# EAGLE schematic Omniband_v1-05-22_EVT_TPS_30101DRI_PL_FIR_QFN (EAGLE 9.6.2)
COMPANY: ADAFRUIT INDUSTRIES; DRAWN: KTOWN; REV: F
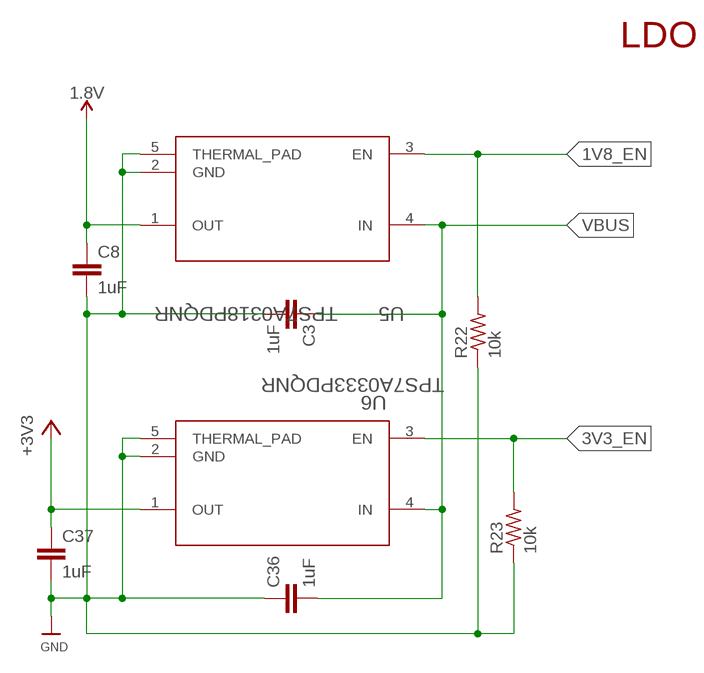
[diagram p0: schematic, sheet 1]

## Parts
C3  1uF  C-EUC0201  [C0201]
C8  1uF  C-EUC0201  [C0201]
C36  1uF  C-EUC0201  [C0201]
C37  1uF  C-EUC0201  [C0201]
R22  10k  R-US_R0201  [R0201]
R23  10k  R-US_R0201  [R0201]
U5  TPS7A0318PDQNR  [DQN0004A-MFG]
U6  TPS7A0333PDQNR  [DQN0004A-MFG]

## Nets
1.8V [POWER]: C8.1 U5.1(OUT)
1V8_EN: R22.2 U5.3(EN)
3V3_EN: R23.2 U6.3(EN)
+3V3: C37.1 U6.1(OUT)
GND: C3.2 C8.2 C36.1 C37.2 R22.1 R23.1 U5.2(GND) U5.5(THERMAL_PAD) U6.2(GND) U6.5(THERMAL_PAD)
VBUS [POWER]: C3.1 C36.2 U5.4(IN) U6.4(IN)

## Notes on the sheet
- LDO

## Library data of the parts
C3 C8 C36 C37 = rcl:C-EU: CAPACITOR, European symbol; SPICEPREFIX: C
R22 R23 = rcl:R-US_: RESISTOR, American symbol; SPICEPREFIX: R
U5 = my_library:TPS7A0318PDQNR; COPYRIGHT: Copyright (C) 2025 Ultra Librarian. All rights reserved.; MANUFACTURER_PART_NUMBER: TPS7A0318PDQNR; MFR_NAME: Texas Instruments; REFDES: RefDes; TYPE: TYPE
U6 = my_library:TPS7A0333PDQNR; COPYRIGHT: Copyright (C) 2025 Ultra Librarian. All rights reserved.; MANUFACTURER_PART_NUMBER: TPS7A0333PDQNR; MFR_NAME: Texas Instruments; REFDES: RefDes; TYPE: TYPE

## Net classes
1 POWER: width 0.127 mm